# EAGLE schematic Zvuk9_R2 (EAGLE 7.4.0)
test description
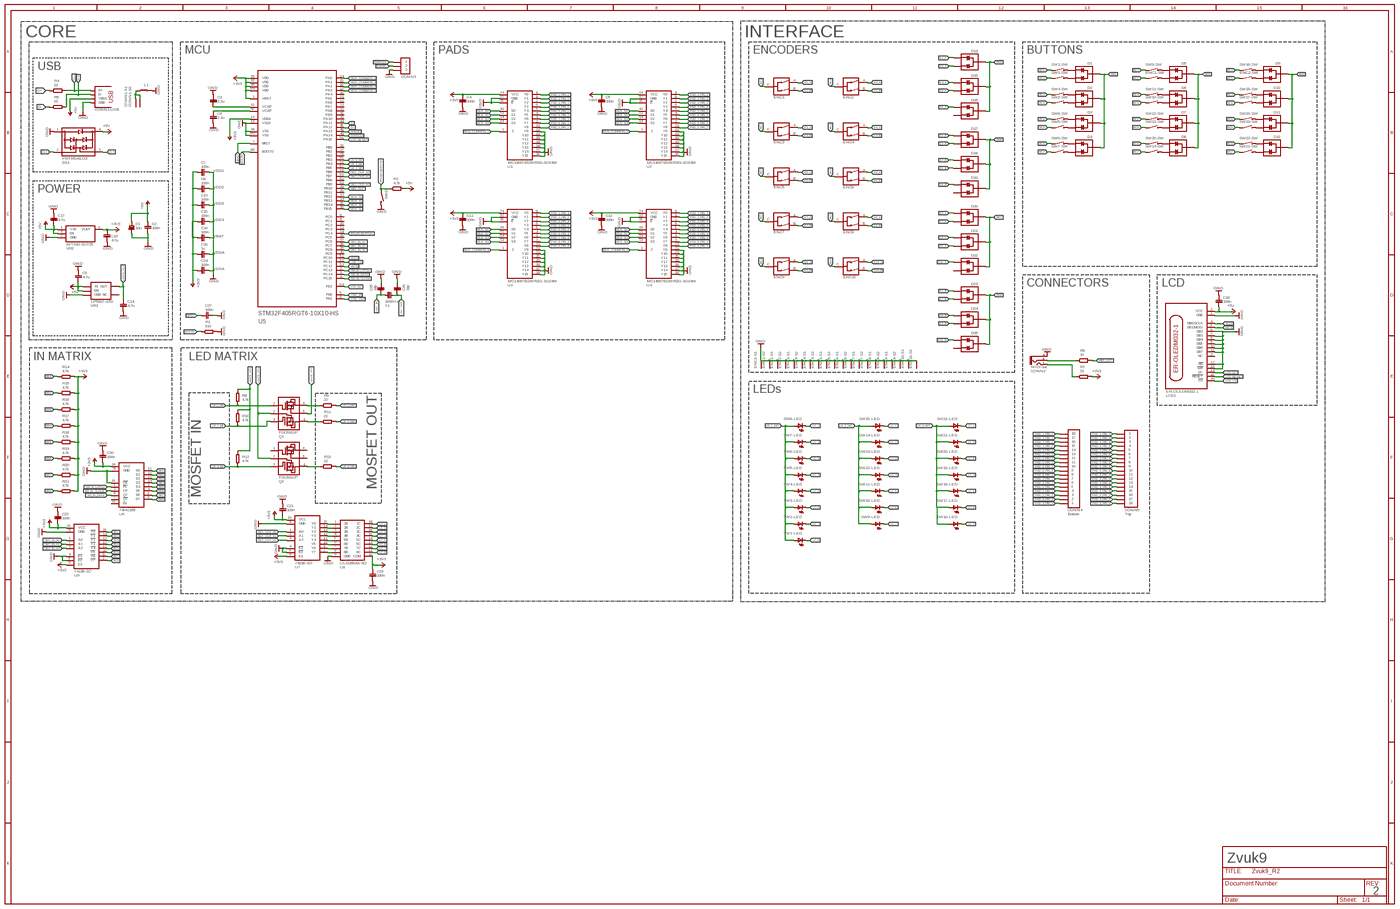
[diagram p0: schematic, sheet 1, overview]
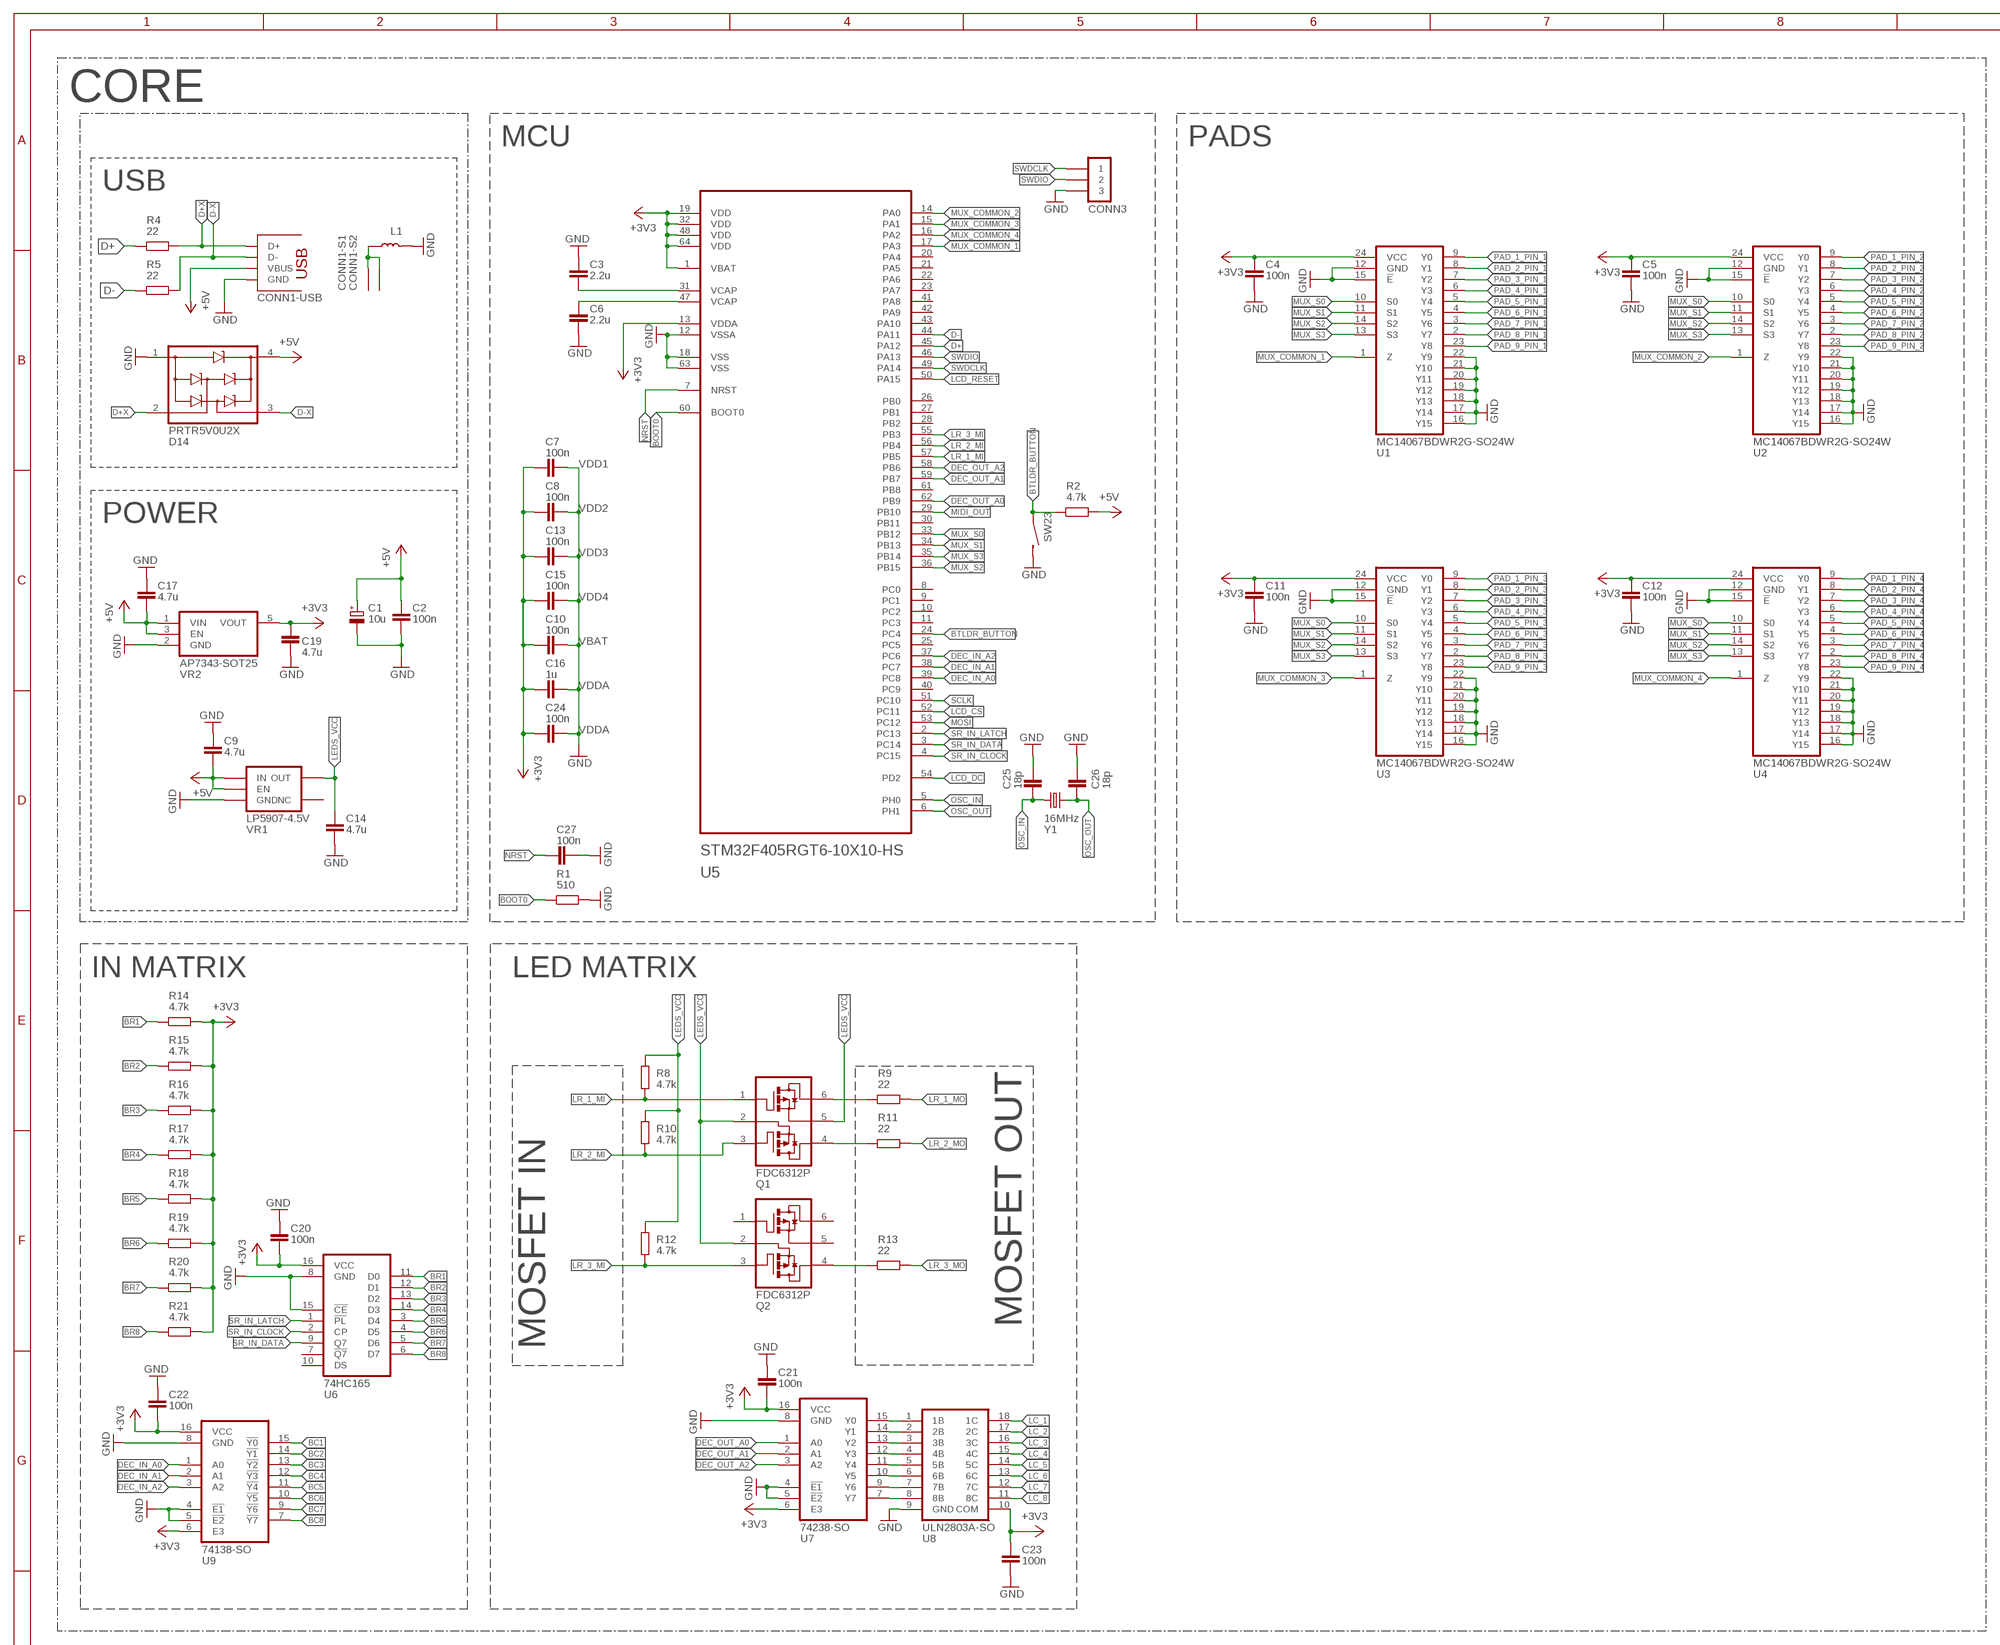
[diagram p1: schematic, sheet 1, part 1 of 4]
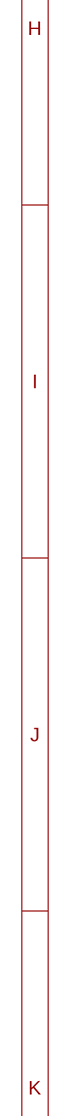
[diagram p2: schematic, sheet 1, part 2 of 4]
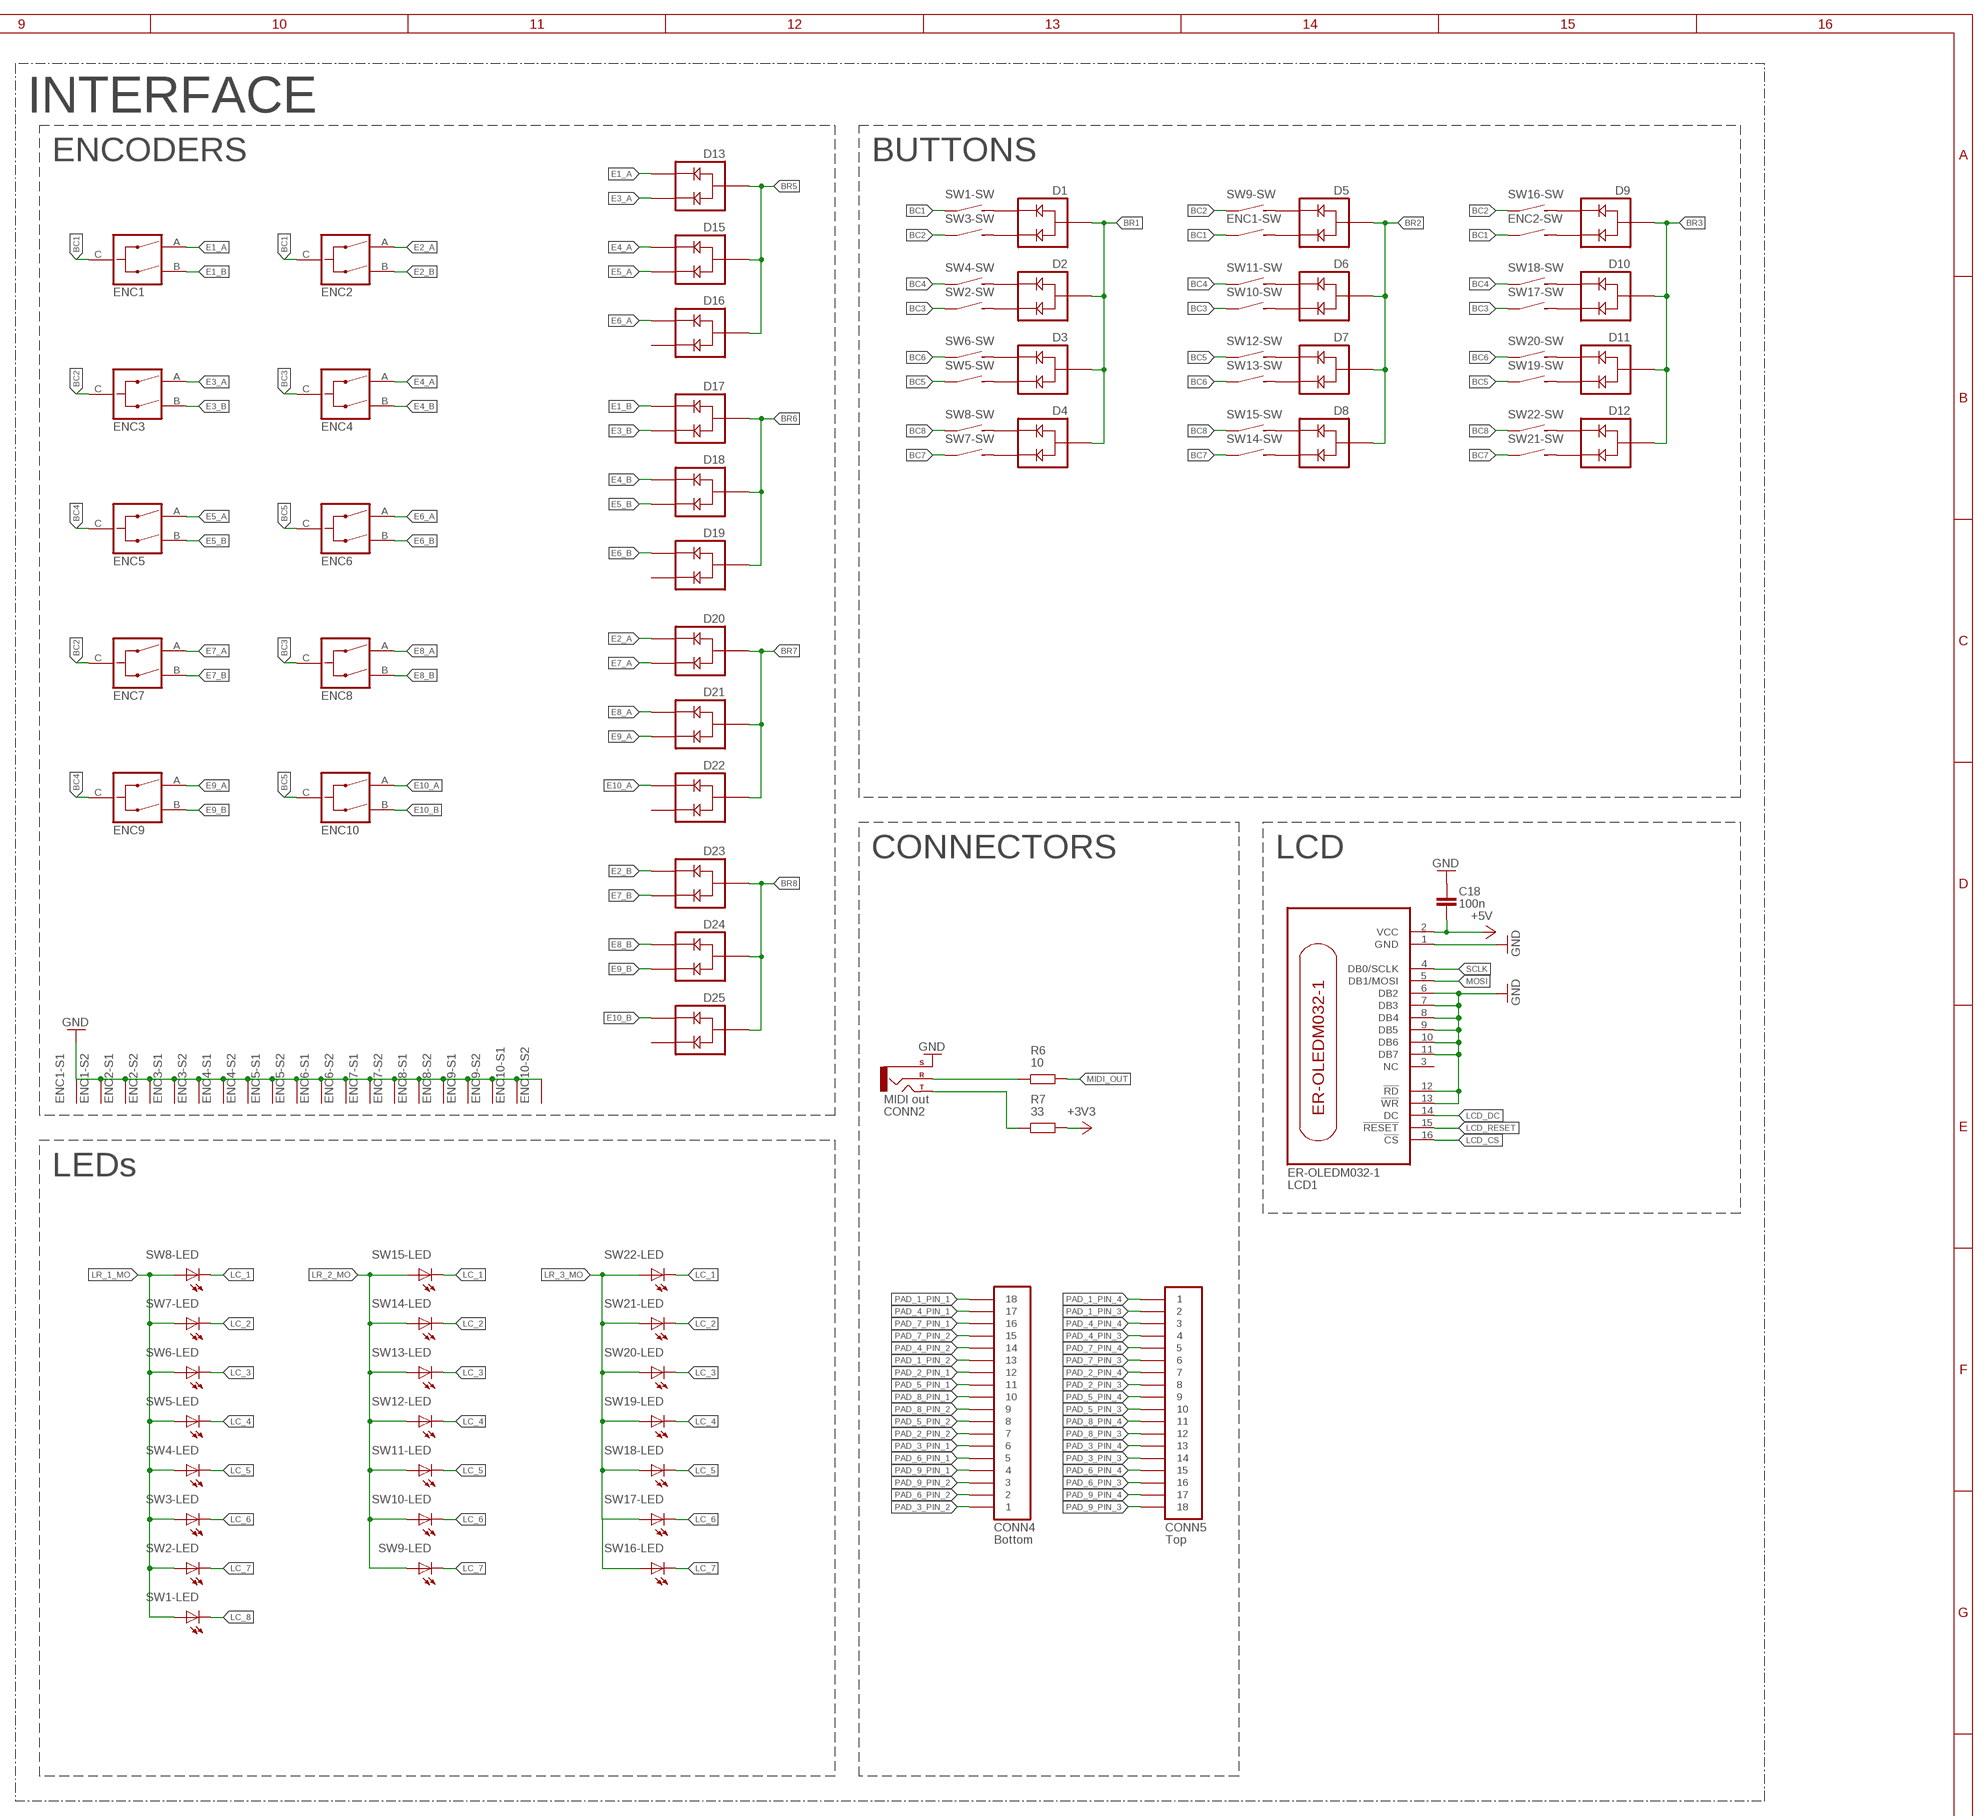
[diagram p3: schematic, sheet 1, part 3 of 4]
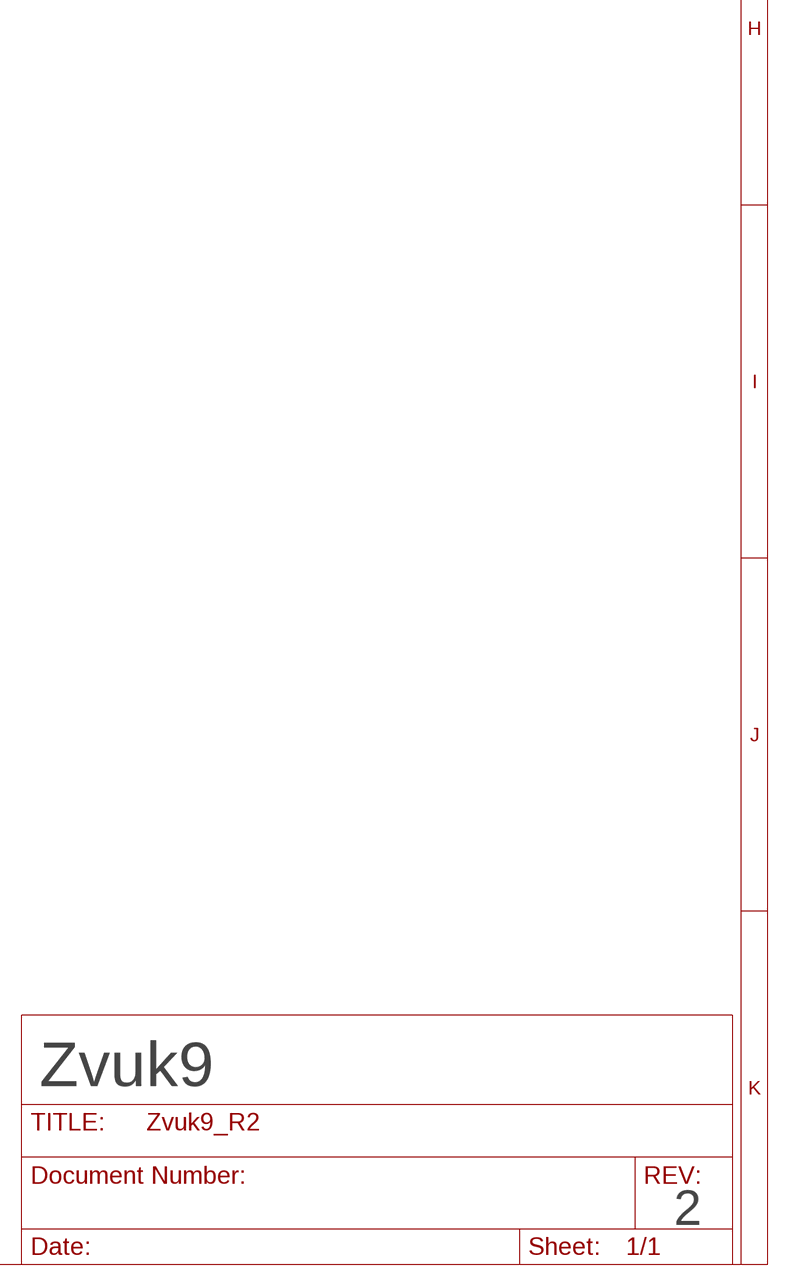
[diagram p4: schematic, sheet 1, part 4 of 4]

## Parts
C1  10u  ELECTROLYTIC_CAPACITOR-C-TH-E-0502  [C-TH-E-0502]
C2  100n  CAPACITOR-0805  [C0805]
C3  2.2u  CAPACITOR-0805  [C0805]
C4  100n  CAPACITOR-0805  [C0805]
C5  100n  CAPACITOR-0805  [C0805]
C6  2.2u  CAPACITOR-0805  [C0805]
C7  100n  CAPACITOR-0805  [C0805]
C8  100n  CAPACITOR-0805  [C0805]
C9  4.7u  CAPACITOR-0805  [C0805]
C10  100n  CAPACITOR-0805  [C0805]
C11  100n  CAPACITOR-0805  [C0805]
C12  100n  CAPACITOR-0805  [C0805]
C13  100n  CAPACITOR-0805  [C0805]
C14  4.7u  CAPACITOR-0805  [C0805]
C15  100n  CAPACITOR-0805  [C0805]
C16  1u  CAPACITOR-0805  [C0805]
C17  4.7u  CAPACITOR-0805  [C0805]
C18  100n  CAPACITOR-0805  [C0805]
C19  4.7u  CAPACITOR-0805  [C0805]
C20  100n  CAPACITOR-0805  [C0805]
C21  100n  CAPACITOR-0805  [C0805]
C22  100n  CAPACITOR-0805  [C0805]
C23  100n  CAPACITOR-0805  [C0805]
C24  100n  CAPACITOR-0805  [C0805]
C25  18p  CAPACITOR-0805  [C0805]
C26  18p  CAPACITOR-0805  [C0805]
C27  100n  CAPACITOR-0805  [C0805]
CONN1  USB-B-H  [USB-B-PTH]
CONN2  MIDI out  3.5MM-AUDIO-3P-SJI-3523N  [SJ1-3523N]
CONN3  PINHD-1X03-TH-2.54MM  [1X03-2.54-V]
CONN4  PINHD-1X18-FFC-SMD-1MM  [MOLEX-52271-1879]
CONN5  PINHD-1X18-FFC-SMD-1MM  [MOLEX-52271-1879]
D1  BAW56  [SOT23]
D2  BAW56  [SOT23]
D3  BAW56  [SOT23]
D4  BAW56  [SOT23]
D5  BAW56  [SOT23]
D6  BAW56  [SOT23]
D7  BAW56  [SOT23]
D8  BAW56  [SOT23]
D9  BAW56  [SOT23]
D10  BAW56  [SOT23]
D11  BAW56  [SOT23]
D12  BAW56  [SOT23]
D13  BAW56  [SOT23]
D14  PRTR5V0U2X  [SOT143]
D15  BAW56  [SOT23]
D16  BAW56  [SOT23]
D17  BAW56  [SOT23]
D18  BAW56  [SOT23]
D19  BAW56  [SOT23]
D20  BAW56  [SOT23]
D21  BAW56  [SOT23]
D22  BAW56  [SOT23]
D23  BAW56  [SOT23]
D24  BAW56  [SOT23]
D25  BAW56  [SOT23]
ENC1  ALPS-EC12D1524403  [ALPS_EC12-SW]
ENC2  ALPS-EC12D1524403  [ALPS_EC12-SW]
ENC3  ALPS-EC12E24404AX  [EC12E-1]
ENC4  ALPS-EC12E24404AX  [EC12E-1]
ENC5  ALPS-EC12E24404AX  [EC12E-1]
ENC6  ALPS-EC12E24404AX  [EC12E-1]
ENC7  ALPS-EC12E24404AX  [EC12E-1]
ENC8  ALPS-EC12E24404AX  [EC12E-1]
ENC9  ALPS-EC12E24404AX  [EC12E-1]
ENC10  ALPS-EC12E24404AX  [EC12E-1]
L1  FERRITE_BEAD-BLM21PG221SN1D  [L0805]
LCD1  ER-OLEDM032-1  [ER-OLEDM032-W]
Q1  FDC6312P  [SSOT6]
Q2  FDC6312P  [SSOT6]
R1  510  RESISTOR-0805  [R0805]
R2  4.7k  RESISTOR-0805  [R0805]
R4  22  RESISTOR-0805  [R0805]
R5  22  RESISTOR-0805  [R0805]
R6  10  RESISTOR-0805  [R0805]
R7  33  RESISTOR-0805  [R0805]
R8  4.7k  RESISTOR-0805  [R0805]
R9  22  RESISTOR-0805  [R0805]
R10  4.7k  RESISTOR-0805  [R0805]
R11  22  RESISTOR-0805  [R0805]
R12  4.7k  RESISTOR-0805  [R0805]
R13  22  RESISTOR-0805  [R0805]
R14  4.7k  RESISTOR-0805  [R0805]
R15  4.7k  RESISTOR-0805  [R0805]
R16  4.7k  RESISTOR-0805  [R0805]
R17  4.7k  RESISTOR-0805  [R0805]
R18  4.7k  RESISTOR-0805  [R0805]
R19  4.7k  RESISTOR-0805  [R0805]
R20  4.7k  RESISTOR-0805  [R0805]
R21  4.7k  RESISTOR-0805  [R0805]
SW1  OMRON-B3W-9  [OMRON-B3W-9]
SW2  OMRON-B3W-9  [OMRON-B3W-9]
SW3  OMRON-B3W-9  [OMRON-B3W-9]
SW4  OMRON-B3W-9  [OMRON-B3W-9]
SW5  OMRON-B3W-9  [OMRON-B3W-9]
SW6  OMRON-B3W-9  [OMRON-B3W-9]
SW7  OMRON-B3W-9  [OMRON-B3W-9]
SW8  OMRON-B3W-9  [OMRON-B3W-9]
SW9  OMRON-B3W-9  [OMRON-B3W-9]
SW10  OMRON-B3W-9  [OMRON-B3W-9]
SW11  OMRON-B3W-9  [OMRON-B3W-9]
SW12  OMRON-B3W-9  [OMRON-B3W-9]
SW13  OMRON-B3W-9  [OMRON-B3W-9]
SW14  OMRON-B3W-9  [OMRON-B3W-9]
SW15  OMRON-B3W-9  [OMRON-B3W-9]
SW16  OMRON-B3W-9  [OMRON-B3W-9]
SW17  OMRON-B3W-9  [OMRON-B3W-9]
SW18  OMRON-B3W-9  [OMRON-B3W-9]
SW19  OMRON-B3W-9  [OMRON-B3W-9]
SW20  OMRON-B3W-9  [OMRON-B3W-9]
SW21  OMRON-B3W-9  [OMRON-B3W-9]
SW22  OMRON-B3W-9  [OMRON-B3W-9]
SW23  SWITCH-B3F  [B3F-312X]
U1  MC14067BDWR2G-SO24W  [SO24-W]
U2  MC14067BDWR2G-SO24W  [SO24-W]
U3  MC14067BDWR2G-SO24W  [SO24-W]
U4  MC14067BDWR2G-SO24W  [SO24-W]
U5  STM32F405RGT6-10X10-HS  [TQFP-64-10X10-HS]
U6  74HC165  [SO16]
U7  74238-SO  74HC238-SO  [SO16]
U8  ULN2803A-SO  [SO18]
U9  74138-SO  74HC138-SO  [SO16]
VR1  LP5907-4.5V  [SOT23-5]
VR2  AP7343-SOT25  [SOT25]
Y1  16MHz  CRYSTAL-HC49  [HC49US]

## Nets
+3V3: C4.1 C5.1 C7.1 C8.1 C10.1 C11.1 C12.1 C13.1 C15.1 C16.1 C19.1 C20.2 C21.2 C22.2 C23.1 C24.1 R7.2 R14.2 R15.2 R16.2 R17.2 R18.2 R19.2 R20.2 R21.2 U1.24(VCC) U2.24(VCC) U3.24(VCC) U4.24(VCC) U5.1(VBAT) U5.13(VDDA) U5.19(VDD) U5.32(VDD) U5.48(VDD) U5.64(VDD) U6.16(VCC) U7.6(E3) U7.16(VCC) U8.10(COM) U9.6(E3) U9.16(VCC) VR2.5(VOUT)
+5V: C1.+ C2.1 C9.2 C17.2 C18.2 CONN1.VBUS(-USB:VBUS) D14.4(VCC) LCD1.2(VCC) R2.2 VR1.1(IN) VR1.3(EN) VR2.1(VIN) VR2.3(EN)
BC1: ENC1.C ENC1.D ENC2.C ENC2.D SW1.1 U9.15(!Y0)
BC2: ENC3.C ENC7.C SW3.1 SW9.1 SW16.1 U9.14(!Y1)
BC3: ENC4.C ENC8.C SW2.1 SW10.1 SW17.1 U9.13(!Y2)
BC4: ENC5.C ENC9.C SW4.1 SW11.1 SW18.1 U9.12(!Y3)
BC5: ENC6.C ENC10.C SW5.1 SW12.1 SW19.1 U9.11(!Y4)
BC6: SW6.1 SW13.1 SW20.1 U9.10(!Y5)
BC7: SW7.1 SW14.1 SW21.1 U9.9(!Y6)
BC8: SW8.1 SW15.1 SW22.1 U9.7(!Y7)
BOOT0: R1.1 U5.60(BOOT0)
BR1: D1.3 D2.3 D3.3 D4.3 R14.1 U6.11(D0)
BR2: D5.3 D6.3 D7.3 D8.3 R15.1 U6.12(D1)
BR3: D9.3 D10.3 D11.3 D12.3 R16.1 U6.13(D2)
BR4: R17.1 U6.14(D3)
BR5: D13.3 D15.3 D16.3 R18.1 U6.3(D4)
BR6: D17.3 D18.3 D19.3 R19.1 U6.4(D5)
BR7: D20.3 D21.3 D22.3 R20.1 U6.5(D6)
BR8: D23.3 D24.3 D25.3 R21.1 U6.6(D7)
BTLDR_BUTTON: R2.1 SW23.1 U5.24(PC4)
D+: R4.1 U5.45(PA12)
D+X: CONN1.D+(-USB:D+) D14.2(I/O1) R4.2
D-: R5.1 U5.44(PA11)
D-X: CONN1.D-(-USB:D-) D14.3(I/O2) R5.2
DEC_IN_A0: U5.39(PC8) U9.1(A0)
DEC_IN_A1: U5.38(PC7) U9.2(A1)
DEC_IN_A2: U5.37(PC6) U9.3(A2)
DEC_OUT_A0: U5.62(PB9) U7.1(A0)
DEC_OUT_A1: U5.59(PB7) U7.2(A1)
DEC_OUT_A2: U5.58(PB6) U7.3(A2)
E1_A: D13.1 ENC1.A
E1_B: D17.1 ENC1.B
E2_A: D20.1 ENC2.A
E2_B: D23.1 ENC2.B
E3_A: D13.2 ENC3.A
E3_B: D17.2 ENC3.B
E4_A: D15.1 ENC4.A
E4_B: D18.1 ENC4.B
E5_A: D15.2 ENC5.A
E5_B: D18.2 ENC5.B
E6_A: D16.1 ENC6.A
E6_B: D19.1 ENC6.B
E7_A: D20.2 ENC7.A
E7_B: D23.2 ENC7.B
E8_A: D21.1 ENC8.A
E8_B: D24.1 ENC8.B
E9_A: D21.2 ENC9.A
E9_B: D24.2 ENC9.B
E10_A: D22.1 ENC10.A
E10_B: D25.1 ENC10.B
GND: C1.- C2.2 C3.1 C4.2 C5.2 C6.2 C7.2 C8.2 C9.1 C10.2 C11.2 C12.2 C13.2 C14.2 C15.2 C16.2 C17.1 C18.1 C19.2 C20.1 C21.1 C22.1 C23.2 C24.2 C25.2 C26.2 C27.2 CONN1.GND(-USB:GND) CONN2.1(SLEEVE) CONN3.3 D14.1(GND) ENC1.S1(S) ENC1.S2(S) ENC2.S1(S) ENC2.S2(S) ENC3.S1(S) ENC3.S2(S) ENC4.S1(S) ENC4.S2(S) ENC5.S1(S) ENC5.S2(S) ENC6.S1(S) ENC6.S2(S) ENC7.S1(S) ENC7.S2(S) ENC8.S1(S) ENC8.S2(S) ENC9.S1(S) ENC9.S2(S) ENC10.S1(S) ENC10.S2(S) L1.2 LCD1.1(GND) LCD1.6(DB2) LCD1.7(DB3) LCD1.8(DB4) LCD1.9(DB5) LCD1.10(DB6) LCD1.11(DB7) LCD1.12(!RD) LCD1.13(!WR) R1.2 SW23.2 U1.12(GND) U1.15(!E) U1.16(Y15) U1.17(Y14) U1.18(Y13) U1.19(Y12) U1.20(Y11) U1.21(Y10) U1.22(Y9) U2.12(GND) U2.15(!E) U2.16(Y15) U2.17(Y14) U2.18(Y13) U2.19(Y12) U2.20(Y11) U2.21(Y10) U2.22(Y9) U3.12(GND) U3.15(!E) U3.16(Y15) U3.17(Y14) U3.18(Y13) U3.19(Y12) U3.20(Y11) U3.21(Y10) U3.22(Y9) U4.12(GND) U4.15(!E) U4.16(Y15) U4.17(Y14) U4.18(Y13) U4.19(Y12) U4.20(Y11) U4.21(Y10) U4.22(Y9) U5.12(VSSA) U5.18(VSS) U5.63(VSS) U6.8(GND) U6.15(!CE) U7.4(!E1) U7.5(!E2) U7.8(GND) U8.9(GND) U9.4(!E1) U9.5(!E2) U9.8(GND) VR1.2(GND) VR2.2(GND)
LC_1: SW8.6-C(-LED:C) SW15.6-C(-LED:C) SW22.6-C(-LED:C) U8.18(1C)
LC_2: SW7.6-C(-LED:C) SW14.6-C(-LED:C) SW21.6-C(-LED:C) U8.17(2C)
LC_3: SW6.6-C(-LED:C) SW13.6-C(-LED:C) SW20.6-C(-LED:C) U8.16(3C)
LC_4: SW5.6-C(-LED:C) SW12.6-C(-LED:C) SW19.6-C(-LED:C) U8.15(4C)
LC_5: SW4.6-C(-LED:C) SW11.6-C(-LED:C) SW18.6-C(-LED:C) U8.14(5C)
LC_6: SW3.6-C(-LED:C) SW10.6-C(-LED:C) SW17.6-C(-LED:C) U8.13(6C)
LC_7: SW2.6-C(-LED:C) SW9.6-C(-LED:C) SW16.6-C(-LED:C) U8.12(7C)
LC_8: SW1.6-C(-LED:C) U8.11(8C)
LCD_CS: LCD1.16(!CS) U5.52(PC11)
LCD_DC: LCD1.14(DC) U5.54(PD2)
LCD_RESET: LCD1.15(!RESET) U5.50(PA15)
LEDS_VCC: C14.1 Q1.2(S2) Q1.5(S1) Q2.2(S2) R8.1 R10.1 R12.1 VR1.5(OUT)
LR_1_MI: Q1.1(G1) R8.2 U5.57(PB5)
LR_1_MO: R9.2 SW1.6-A(-LED:A) SW2.6-A(-LED:A) SW3.6-A(-LED:A) SW4.6-A(-LED:A) SW5.6-A(-LED:A) SW6.6-A(-LED:A) SW7.6-A(-LED:A) SW8.6-A(-LED:A)
LR_2_MI: Q1.3(G2) R10.2 U5.56(PB4)
LR_2_MO: R11.2 SW9.6-A(-LED:A) SW10.6-A(-LED:A) SW11.6-A(-LED:A) SW12.6-A(-LED:A) SW13.6-A(-LED:A) SW14.6-A(-LED:A) SW15.6-A(-LED:A)
LR_3_MI: Q2.3(G2) R12.2 U5.55(PB3)
LR_3_MO: R13.2 SW16.6-A(-LED:A) SW17.6-A(-LED:A) SW18.6-A(-LED:A) SW19.6-A(-LED:A) SW20.6-A(-LED:A) SW21.6-A(-LED:A) SW22.6-A(-LED:A)
MIDI_OUT: R6.2 U5.29(PB10)
MOSI: LCD1.5(DB1/MOSI) U5.53(PC12)
MUX_COMMON_1: U1.1(Z) U5.17(PA3)
MUX_COMMON_2: U2.1(Z) U5.14(PA0)
MUX_COMMON_3: U3.1(Z) U5.15(PA1)
MUX_COMMON_4: U4.1(Z) U5.16(PA2)
MUX_S0: U1.10(S0) U2.10(S0) U3.10(S0) U4.10(S0) U5.33(PB12)
MUX_S1: U1.11(S1) U2.11(S1) U3.11(S1) U4.11(S1) U5.34(PB13)
MUX_S2: U1.14(S2) U2.14(S2) U3.14(S2) U4.14(S2) U5.36(PB15)
MUX_S3: U1.13(S3) U2.13(S3) U3.13(S3) U4.13(S3) U5.35(PB14)
N$1: U7.15(Y0) U8.1(1B)
N$2: U7.14(Y1) U8.2(2B)
N$3: U7.13(Y2) U8.3(3B)
N$4: U7.12(Y3) U8.4(4B)
N$5: D1.1 SW1.3
N$6: D2.2 SW2.3
N$7: CONN2.2(TIP) R7.1
N$8: D2.1 SW4.3
N$9: D1.2 SW3.3
N$10: D3.2 SW5.3
N$11: D3.1 SW6.3
N$12: C3.2 U5.31(VCAP)
N$13: C6.1 U5.47(VCAP)
N$14: D4.2 SW7.3
N$15: D4.1 SW8.3
N$16: D5.2 ENC1.E
N$17: D6.2 SW10.3
N$18: D6.1 SW11.3
N$19: D7.1 SW12.3
N$20: D7.2 SW13.3
N$21: D8.2 SW14.3
N$22: D8.1 SW15.3
N$23: D5.1 SW9.3
N$24: D9.2 ENC2.E
N$25: D9.1 SW16.3
N$26: D10.2 SW17.3
N$27: D10.1 SW18.3
N$28: D11.2 SW19.3
N$29: D11.1 SW20.3
N$30: D12.2 SW21.3
N$31: D12.1 SW22.3
N$37: CONN2.3(RING) R6.1
N$38: U7.11(Y4) U8.5(5B)
N$39: U7.10(Y5) U8.6(6B)
N$50: U7.9(Y6) U8.7(7B)
N$51: U7.7(Y7) U8.8(8B)
N$73: Q1.6(D1) R9.1
N$74: Q1.4(D2) R11.1
N$83: Q2.4(D2) R13.1
NRST: C27.1 U5.7(NRST)
OSC_IN: C25.1 U5.5(PH0) Y1.1
OSC_OUT: C26.1 U5.6(PH1) Y1.2
PAD_1_PIN_1: CONN4.18 U1.9(Y0)
PAD_1_PIN_2: CONN4.13 U2.9(Y0)
PAD_1_PIN_3: CONN5.2 U3.9(Y0)
PAD_1_PIN_4: CONN5.1 U4.9(Y0)
PAD_2_PIN_1: CONN4.12 U1.8(Y1)
PAD_2_PIN_2: CONN4.7 U2.8(Y1)
PAD_2_PIN_3: CONN5.8 U3.8(Y1)
PAD_2_PIN_4: CONN5.7 U4.8(Y1)
PAD_3_PIN_1: CONN4.6 U1.7(Y2)
PAD_3_PIN_2: CONN4.1 U2.7(Y2)
PAD_3_PIN_3: CONN5.14 U3.7(Y2)
PAD_3_PIN_4: CONN5.13 U4.7(Y2)
PAD_4_PIN_1: CONN4.17 U1.6(Y3)
PAD_4_PIN_2: CONN4.14 U2.6(Y3)
PAD_4_PIN_3: CONN5.4 U3.6(Y3)
PAD_4_PIN_4: CONN5.3 U4.6(Y3)
PAD_5_PIN_1: CONN4.11 U1.5(Y4)
PAD_5_PIN_2: CONN4.8 U2.5(Y4)
PAD_5_PIN_3: CONN5.10 U3.5(Y4)
PAD_5_PIN_4: CONN5.9 U4.5(Y4)
PAD_6_PIN_1: CONN4.5 U1.4(Y5)
PAD_6_PIN_2: CONN4.2 U2.4(Y5)
PAD_6_PIN_3: CONN5.16 U3.4(Y5)
PAD_6_PIN_4: CONN5.15 U4.4(Y5)
PAD_7_PIN_1: CONN4.16 U1.3(Y6)
PAD_7_PIN_2: CONN4.15 U2.3(Y6)
PAD_7_PIN_3: CONN5.6 U3.3(Y6)
PAD_7_PIN_4: CONN5.5 U4.3(Y6)
PAD_8_PIN_1: CONN4.10 U1.2(Y7)
PAD_8_PIN_2: CONN4.9 U2.2(Y7)
PAD_8_PIN_3: CONN5.12 U3.2(Y7)
PAD_8_PIN_4: CONN5.11 U4.2(Y7)
PAD_9_PIN_1: CONN4.4 U1.23(Y8)
PAD_9_PIN_2: CONN4.3 U2.23(Y8)
PAD_9_PIN_3: CONN5.18 U3.23(Y8)
PAD_9_PIN_4: CONN5.17 U4.23(Y8)
SCLK: LCD1.4(DB0/SCLK) U5.51(PC10)
SR_IN_CLOCK: U5.4(PC15) U6.2(CP)
SR_IN_DATA: U5.3(PC14) U6.9(Q7)
SR_IN_LATCH: U5.2(PC13) U6.1(!PL)
SWDCLK: CONN3.1 U5.49(PA14)
SWDIO: CONN3.2 U5.46(PA13)
USB_SHIELD: CONN1.S1(-S1:S) CONN1.S2(-S2:S) L1.1
Unconnected: D16.2 D19.2 D22.2 D25.2 LCD1.3(NC) Q2.1(G1) Q2.5(S1) Q2.6(D1) U5.8(PC0) U5.9(PC1) U5.10(PC2) U5.11(PC3) U5.20(PA4) U5.21(PA5) U5.22(PA6) U5.23(PA7) U5.25(PC5) U5.26(PB0) U5.27(PB1) U5.28(PB2) U5.30(PB11) U5.40(PC9) U5.41(PA8) U5.42(PA9) U5.43(PA10) U5.61(PB8) U6.7(!Q7) U6.10(DS) VR1.4(NC)

## Notes on the sheet
- CORE | INTERFACE
- MCU | PADS | ENCODERS | BUTTONS
- USB
- VDD1
- VDD2
- POWER
- VDD3
- VDD4
- VBAT
- VDDA
- VDDA
- CONNECTORS | LCD
- IN MATRIX | LED MATRIX
- LEDs
- MOSFET OUT
- MOSFET IN
- Bottom | Top
- Zvuk9
- 2

## Library data of the parts
C1 = igor_lbr:ELECTROLYTIC_CAPACITOR: Electrolytic capacitor
C2-C27 = igor_lbr:CAPACITOR: Capacitor
CONN1 = igor_lbr:USB: USB B connector, horizontal
CONN2 = igor_lbr:3.5MM-AUDIO-3P: 3.5mm audio jack
CONN3 = igor_lbr:PINHD-1X03: Pin Header
CONN4 CONN5 = igor_lbr:PINHD-1X18
D1-D13 D15-D25 = igor_lbr:BAW56: Small Signal Diode; MANUFACTURER: Multicomp; MPN: BAW56-7-F
D14 = igor_lbr:PRTR5V0U2X: Ultra low capacitance double rail-to-rail ESD protection diode; MANUFACTURER: Nexperia; MPN: PRTR5V0U2X
ENC1 ENC2 = igor_lbr:ALPS-EC12D1524403: ALPS encoder with push-button
ENC3-ENC10 = igor_lbr:ALPS-EC12E24404AX: ALPS encoder
L1 = igor_lbr:FERRITE_BEAD: Ferrite Bead; MANUFACTURER: Murata; MPN: BLM21PG221SN1D
LCD1 = igor_lbr:ER-OLEDM032-1: OLED display module with SSD1322 driver.
Q1 Q2 = igor_lbr:FDC6312P: Dual P-channel 1.8V PowerTrench Specified MOSFET; MANUFACTURER: ON Semiconductor; MPN: FDC6312P
R1 R2 R4-R21 = igor_lbr:RESISTOR: Resistor
SW1-SW22 = igor_lbr:OMRON-B3W-9: Illuminated Tactile Switch
SW23 = igor_lbr:SWITCH: Switch
U1-U4 = igor_lbr:MC14067BDWR2G: 16-Channel Analog Multiplexer/Demultiplexer; MANUFACTURER: ON Semiconductor; MPN: MC14067BDWR2G
U5 = igor_lbr:STM32F405RGT6: ARM Cortex-M4 32b MCU+FPU
U6 = igor_lbr:74*165: 8-bit parallel-in/serial out shift register; MANUFACTURER: Nexperia; MPN: 74HC165D
U7 = igor_lbr:74*238: 74HC238/74HCT238 3-to-8 line decoder/demultiplexer; MANUFACTURER: Nexperia; MPN: 74HC238D
U8 = igor_lbr:ULN2803A: ULN2803A Darlington Transistor Arrays; MANUFACTURER: Texas Instruments; MPN: ULN2803ADWR
U9 = igor_lbr:74*138: 3-to-8 line decoder/demultiplexer; inverting; MANUFACTURER: Nexperia; MPN: 74HC138D
VR1 = igor_lbr:LP5907: Ultra Low-Noise, 250-mA Linear LDO Regulator; MANUFACTURER: Texas Instruments; MPN: LP5907MFX-4.5/NOPB
VR2 = igor_lbr:AP7343: 300mA HIGH PSRR LOW NOISE LDO WITH ENABLE; MANUFACTURER: Diodes Incorporated; MPN: AP7343
Y1 = igor_lbr:CRYSTAL: Crystal; MANUFACTURER: TXC; MPN: 9B-16.000MEEJ-B

## Net classes
0 default: width 0.203 mm
1 POWER: width 0.61 mm